# EAGLE design LiFePO4_Charger (EAGLE 9.6.2)
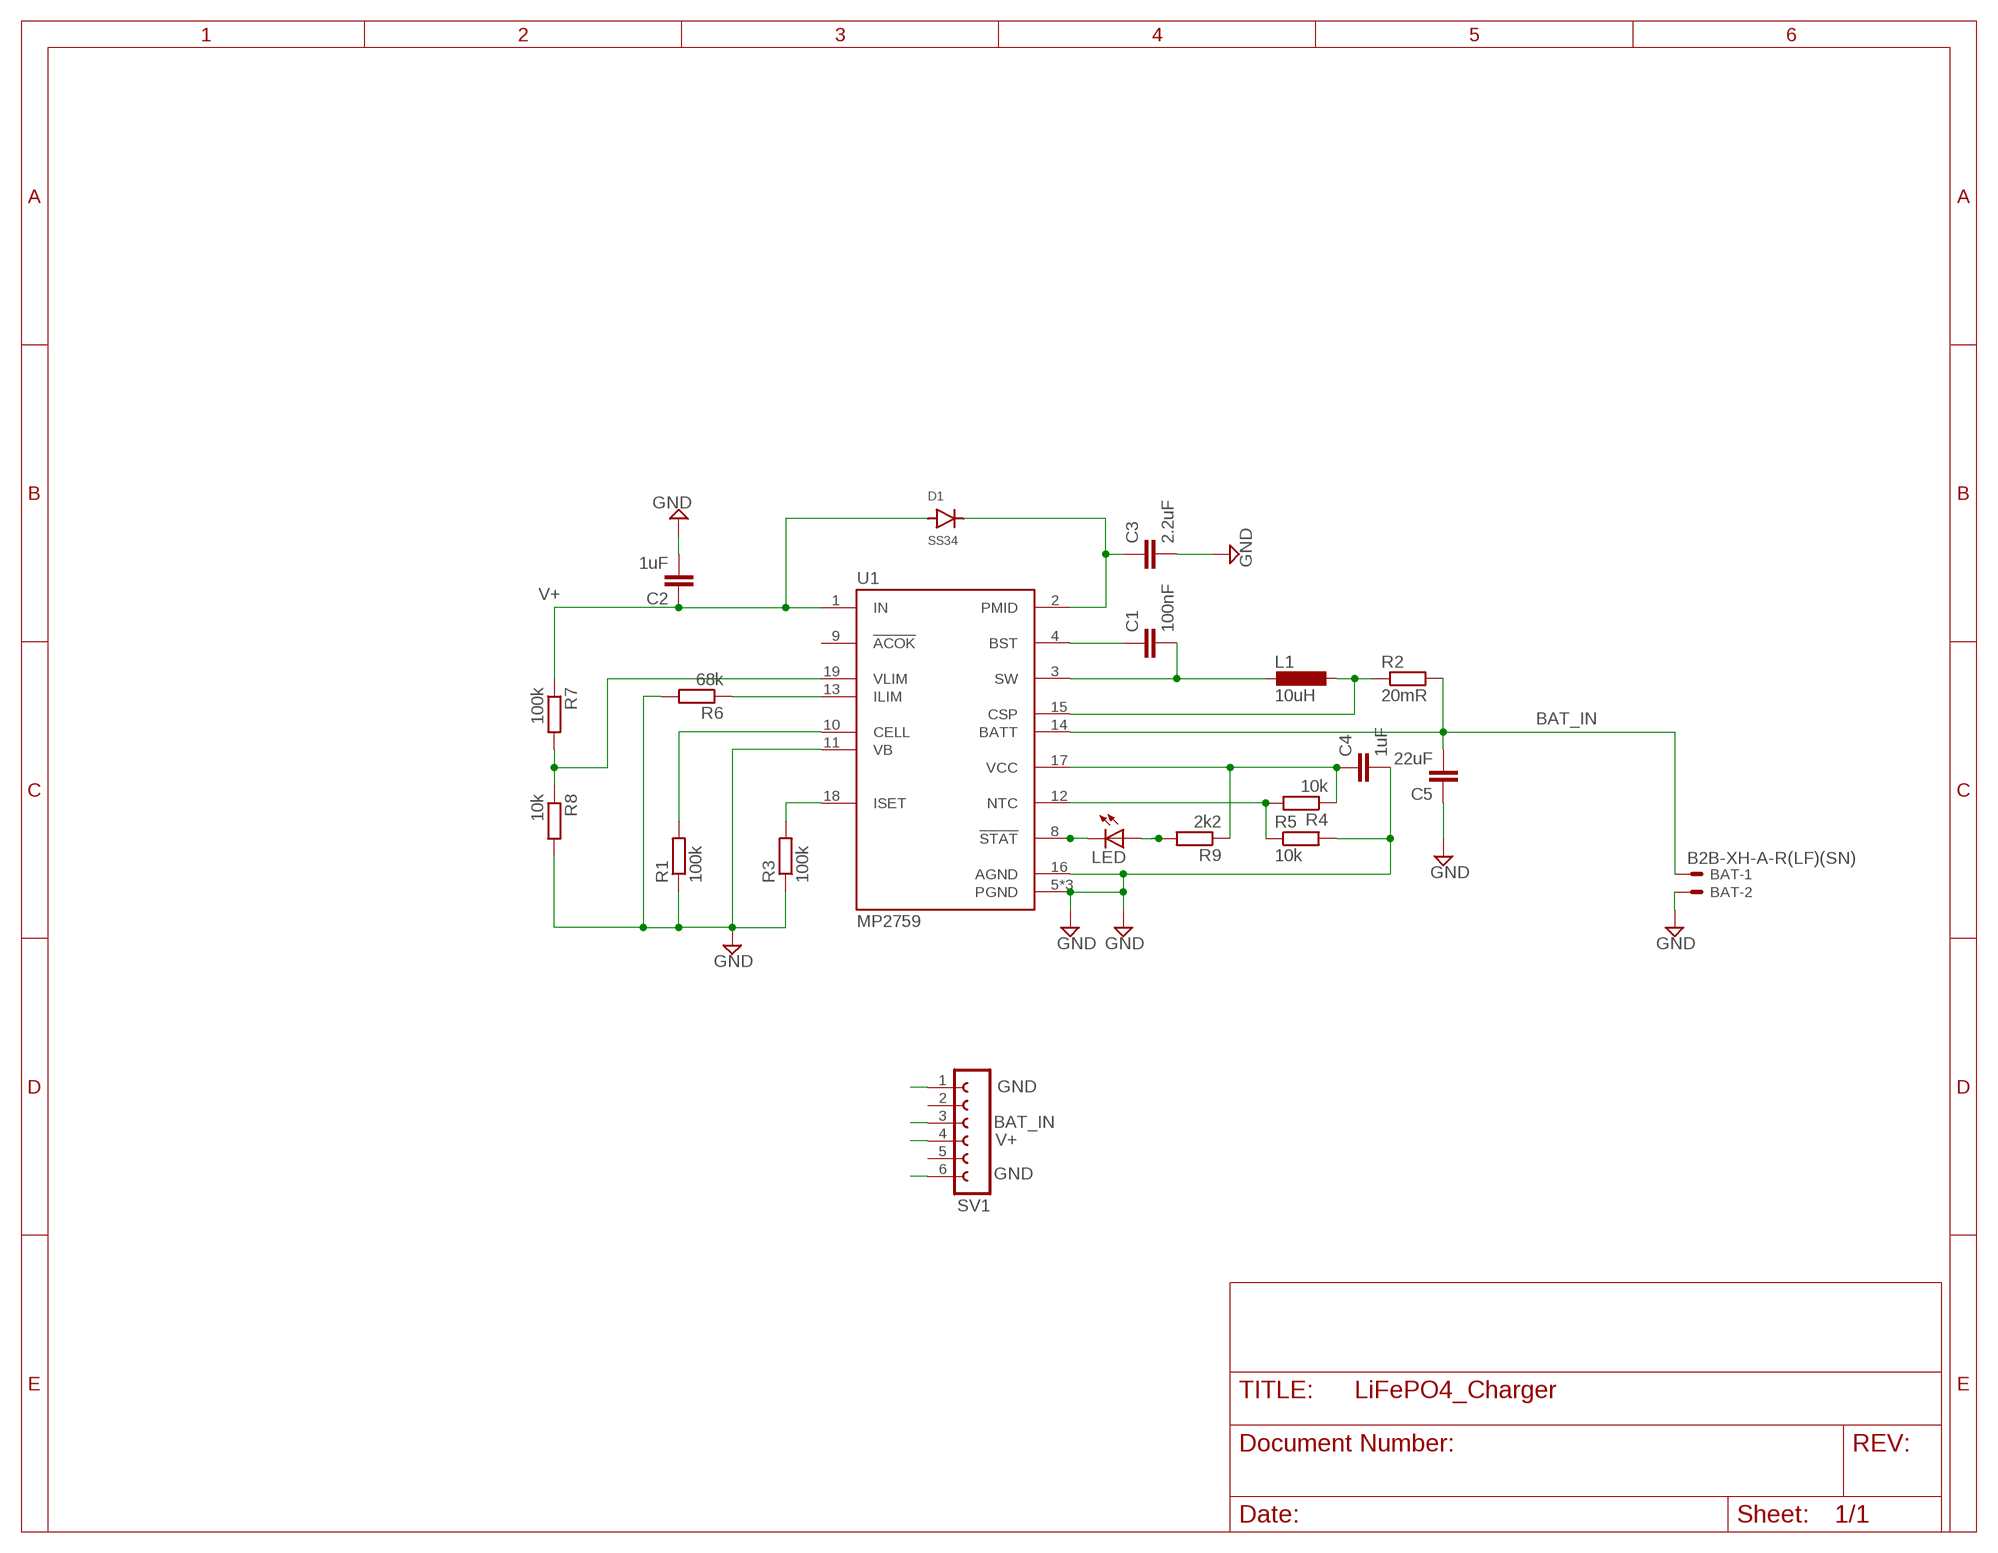
[diagram p0: schematic, sheet 1]

## Parts
BAT  B2B-XH-A-R(LF)(SN)  JST-XH-02-PIN-LONG-PAD  [JST-XH-02-PACKAGE-LONG-PAD]
C1  100nF  C-EUC0805  [C0805]
C2  1uF  C-EUC0805  [C0805]
C3  2.2uF  C-EUC0805  [C0805]
C4  1uF  C-EUC0805  [C0805]
C5  22uF  C-EUC0805  [C0805]
D1  SS34  S1M  [SMA]
L1  10uH  FXL0630-100-M  [FXL0630-100-M]
LED  LEDCHIPLED_0805  [CHIPLED_0805]
R1  100k  R-EU_R0603  [R0603]
R2  20mR  R-EU_R1206  [R1206]
R3  100k  R-EU_R0603  [R0603]
R4  10k  R-EU_R0603  [R0603]
R5  10k  R-EU_R0603  [R0603]
R6  68k  R-EU_R0603  [R0603]
R7  100k  R-EU_R0603  [R0603]
R8  10k  R-EU_R0603  [R0603]
R9  2k2  R-EU_R0603  [R0603]
SV1  FE06W  [FE06W]
U1  MP2759  MP2759GQ-0000-P  [IC_MP2759GQ-0000-P]

## Nets
BAT_IN [pwr]: BAT.1 C5.2 R2.2 SV1.3 U1.14(BATT)
BST: C1.1 U1.4(BST)
GND [pwr]: BAT.2 C2.2 C3.2 C4.2 C5.1 R1.1 R3.1 R5.2 R6.2 R8.2 SV1.1 SV1.6 U1.5(PGND) U1.6(PGND) U1.7(PGND) U1.11(VB) U1.16(AGND)
N$2: R1.2 U1.10(CELL)
N$5: C3.1 D1.C U1.2(PMID)
N$7: L1.P$2 R2.1 U1.15(CSP)
N$9: R3.2 U1.18(ISET)
N$11: R4.2 R5.1 U1.12(NTC)
N$12: R6.1 U1.13(ILIM)
N$13: LED.C U1.8(!STAT)
N$14: R7.2 R8.1 U1.19(VLIM)
N$15: LED.A R9.2
SW [pwr]: C1.2 L1.P$1 U1.3(SW)
V+ [pwr]: C2.1 D1.A R7.1 SV1.4 U1.1(IN)
VCC: C4.1 R4.1 R9.1 U1.17(VCC)
Unconnected: SV1.2 SV1.5 U1.9(!ACOK)

## Library data of the parts
BAT = Rembrandt Electronics - JST XH Connectors v1-0:JST-XH-02-PIN: JST XH Connector 2 Pin Wire to board connector. Pitch: 2,54 mm, (0.100") Number of pins: 2 Created by Rembrandt Electronics www.rembrandtelectronics.com
C1-C5 = rcl:C-EU: CAPACITOR, European symbol; SPICEPREFIX: C
D1 = diode:S1M
L1 = MK312parts:FXL0630-100-M
LED = adafruit:LED: LED OSRAM: - CHIPLED LG R971, LG N971, LY N971, LG Q971, LY Q971, LO R971, LY R971 LH N974, LH R974 LS Q976, LO Q976, LY Q976 LO Q996 - Hyper CHIPLED LW Q18S LB Q993, LB Q99A, LB R99A - SideLED LS A670, LO A670, LY A670, LG A670, LP A670 LB A673, LV A673, LT A673, LW A673 LH A674 LY A675 LS A676, LA A676, LO A676, LY A676, LW A676 LS A679, LY A679, LG A679 - Hyper Micro SIDELED® LS Y876, LA Y876, LO Y876, LY Y876 LT Y87S - SmartLED LW L88C, LW L88S LB L89C, LB L89S, LG L890 LS L89K, LO L89K, LY L89K LS L896, LA L896, LO L896, LY L896 - TOPLED LS T670, LO T670, LY T670, LG T670, LP T670 LSG T670, LSP T670, LSY T670, LOP T670, LYG T670 LG T671, LOG T671, LSG T671 LB T673, LV T673, LT T673, LW T673 LH T674 LS T676, LA T676, LO T676, LY T676, LB T676, LH T676, LSB T676, LW T676 LB T67C, LV T67C, LT T67C, LS T67K, LO T67K, LY T67K, LW E67C LS E67B, LA E67B, LO E67B, LY E67B, LB E67C, LV E67C, LT E67C LW T67C LS T679, LY T679, LG T679 LS T770, LO T770, LY T770, LG T770, LP T770 LB T773, LV T773, LT T773, LW T773 LH T774 LS E675, LA E675, LY E675, LS T675 LS T776, LA T776, LO T776, LY T776, LB T776 LHGB T686 LT T68C, LB T68C - Hyper Mini TOPLED® LB M676 - Mini TOPLED Santana® LG M470 LS M47K, LO M47K, LY M47K Source: http://www.osram.convergy.de/
R1-R9 = rcl:R-EU_: RESISTOR, European symbol; SPICEPREFIX: R
SV1 = con-lsta:FE06W: FEMALE HEADER; OC_FARNELL: unknown; OC_NEWARK: unknown
U1 = SnapEDA:MP2759GQ-0000-P: Check availability <https://pricing.snapeda.com/parts/MP2759GQ-0000-P/Monolithic%20Power%20Systems%20Inc./view-part?ref=eda>; AVAILABILITY: In Stock; CHECK_PRICES: https://www.snapeda.com/parts/MP2759GQ-0000-P/Monolithic+Power+Systems/view-part/?ref=eda; DESCRIPTION: Charger IC Lithium Ion/Polymer 19-QFN (3x3); MF: Monolithic Power Systems Inc.; MP: MP2759GQ-0000-P; PACKAGE: PowerVQFN-19 Monolithic Power Systems Inc.; PRICE: None; SNAPEDA_LINK: https://www.snapeda.com/parts/MP2759GQ-0000-P/Monolithic+Power+Systems/view-part/?ref=snap

## Net classes
0 default: width 0.15 mm, drill 0.35 mm, clearance 0.15 mm
2 pwr: width 0.15 mm, drill 0.35 mm, clearance 0.15 mm

## Board
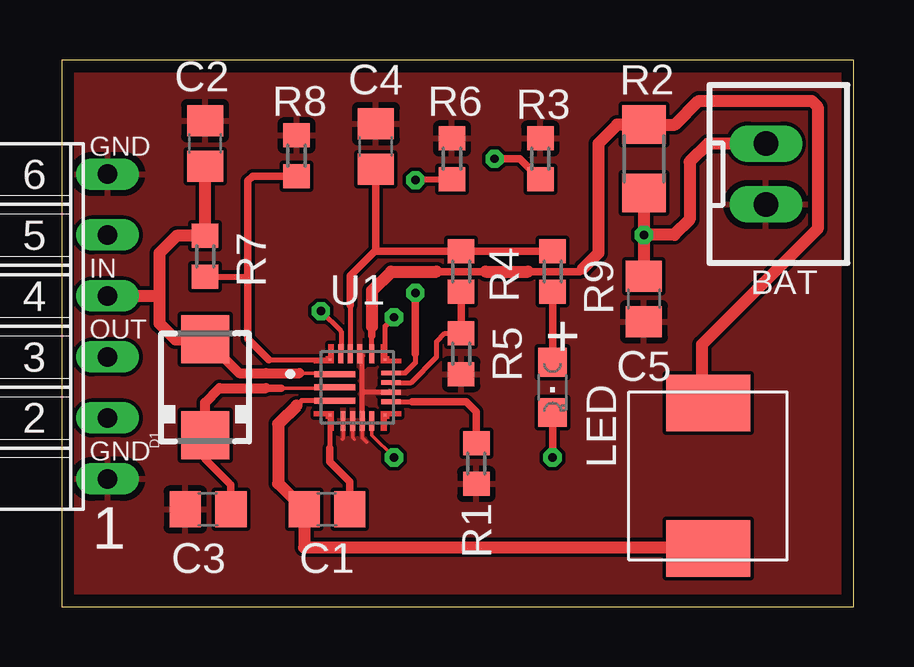
[diagram p1: board, top side]
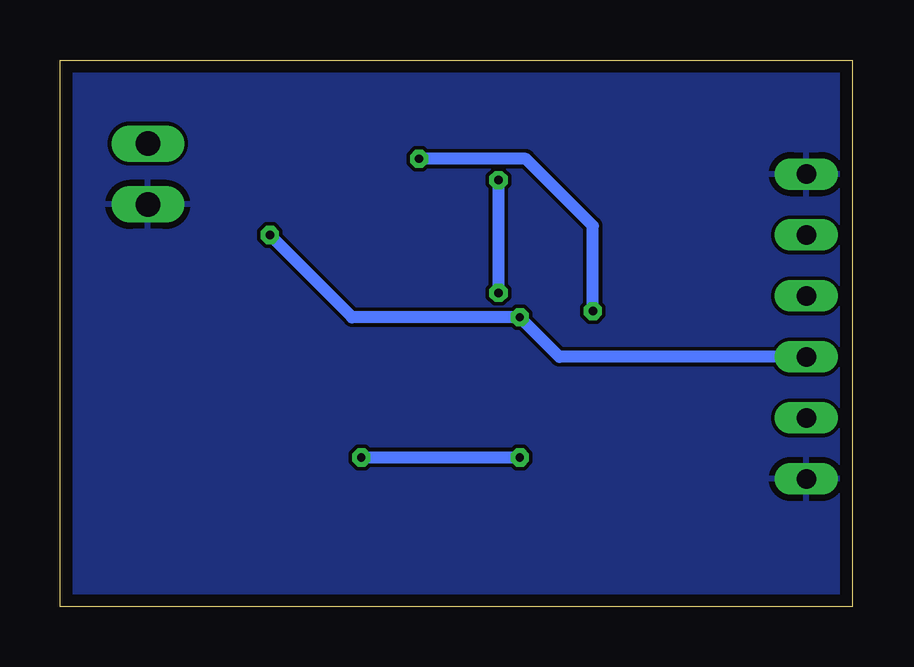
[diagram p2: board, bottom side, seen from below]

Size 33 x 22.78 mm. Coordinates in mm from the lower left corner, seen from the top.
Outline: 0,0 33,0 33,22.78 0,22.78 0,0
Copper layers (1*16): Top 0.035mm / dielectric 1.5mm / Bottom 0.035mm
Design rules "default *": minimum track width 6mil, minimum drill 0.35mm, track to track 6mil, track to pad 6mil, pad to pad 6mil, via to via 6mil, smd to smd 6mil, copper to edge 20mil, drill to drill 6mil, minimum pad ring 10mil, minimum via ring 8mil, stop-mask expansion 4mil, vias tented up to drill 0mil, thermal gap 10mil

### Footprints (pad centres in the part's own frame; a part is rotated, then mirrored left to right if it is on the bottom)
JST-XH-02-PACKAGE-LONG-PAD = drill 1.016 long: 1 -1.27,0; 2 1.27,0
C0805 = smd 1.3 x 1.5: 1 -0.95,0; 2 0.95,0
SMA = smd 2 x 2: A 2,0; C -2,0
FXL0630-100-M = smd 2.37 x 3.5: P$1 -3.03,0; P$2 3.03,0
CHIPLED_0805 = smd 1.2 x 1.2: A 0,-1.05; C 0,1.05
R0603 = smd 1 x 1.1: 1 -0.85,0; 2 0.85,0
R1206 = smd 1.6 x 1.803: 1 -1.422,0; 2 1.422,0
FE06W = drill 0.813 long: 1 -6.35,0; 2 -3.81,0; 3 -1.27,0; 4 1.27,0; 5 3.81,0; 6 6.35,0
IC_MP2759GQ-0000-P = smd 1.7 x 0.25: 1 -0.95,0.55; 2 -0.95,0; 3 -0.95,-0.55 | smd 0.1 x 0.1: 4 -1.15,-1.15; 9 1.15,-1.15; 14 1.15,1.15; 19 -1.15,1.15 | smd 0.2 x 0.8: 5 -0.6,-1.4; 6 -0.2,-1.4; 7 0.2,-1.4; 8 0.6,-1.4; 15 0.6,1.4; 16 0.1,1.4; 17 -0.3,1.4; 18 -0.7,1.4 | smd 0.8 x 0.2: 10 1.4,-0.6; 11 1.4,-0.2; 12 1.4,0.2; 13 1.4,0.6

### Placement (x,y rotation side)
BAT  29.34,18.03 270 top
C1  11.05,4.06 180 top
C2  5.97,19.3 90 top
C3  6.1,4.06 180 top
C4  13.08,19.18 90 top
C5  24.26,12.83 90 top
D1  5.97,9.14 90 top
L1  26.92,5.46 90 top
LED  20.45,9.14 180 top
R1  17.27,5.97 90 top
R2  24.26,18.67 270 top
R3  19.94,18.67 270 top
R4  16.64,13.97 270 top
R5  16.64,10.54 270 top
R6  16.26,18.67 90 top
R7  5.97,14.61 270 top
R8  9.78,18.8 90 top
R9  20.45,13.97 270 top
SV1  1.91,11.68 90 top
U1  12.32,9.14 0 top

### Tracks (layer width: path | path; a pad name or v marks a point on that pad's centre or on a via)
BAT_IN  (via drill 0.35)
  Top 0.2: U1.14 13.47,11.69 v13.84,12.06
  Top 0.508: R2.2 v24.26,15.49 | v24.26,15.49 C5.2 | BAT.1 26.92,19.3 26.16,18.54 26.16,16.13 25.53,15.49 v24.26,15.49
  Bottom 0.508: SV1.3 12.19,10.41 v13.84,12.06 20.83,12.06 v24.26,15.49
BST
  Top 0.2: U1.4 11.17,6.6
  Top 0.305: C1.1 12,5.21 11.17,6.04 11.17,6.6
GND
  Top 0.152: U1.5 11.72,7.02 11.68,6.99 | U1.6 12.12,7.06 12.19,6.99 | U1.7 12.52,7.04 12.7,6.86
  Top 0.203: U1.7 12.52,8.89 | 12.52,8.89 12.52,10.44 U1.16 | U1.11 12.57,8.94 12.52,8.89
  pour Top: 32.51,22.61 32.77,22.35 32.77,0.38 32.51,0.13 0.51,0.13 0.25,0.38 0.25,22.35 0.51,22.61
  pour Bottom: 0.51,22.61 32.51,22.61 32.77,22.35 32.77,0.38 32.51,0.13 0.51,0.13 0.25,0.38 0.25,22.35
N$2
  Top 0.2: U1.10 14.61,8.54
  Top 0.305: 14.61,8.54 16.86,8.54 17.27,8.13 R1.2
N$5
  Top 0.152: 9.14,9.11 11.26,9.11 U1.2
  Top 0.203: D1.C 5.97,6.76
  Top 0.254: 5.97,6.76 5.97,6.16 | 7.05,5.08 6.95,5.17
  Top 0.305: C3.1 7.05,5.08 | 6.95,5.17 5.97,6.16 5.97,7.37 | 8.51,9.11 9.14,9.11
  Top 0.406: D1.C 5.97,7.37 5.97,8.51 6.57,9.11 8.51,9.11
N$7
  Top 0.203: U1.15 12.92,11.3
  Top 0.305: 12.92,11.68 12.92,11.3 | 15.62,13.97 17.65,13.97 | 19.43,13.97 21.59,13.97 21.72,14.1
  Top 0.508: 21.72,14.1 22.35,14.73 22.35,19.3 23.14,20.09 R2.1 25.55,20.09 26.54,21.08 31.24,21.08 31.5,20.83 31.5,15.75 26.67,10.92 26.67,8.74 L1.P$2 | 12.92,11.68 12.92,13.17 13.72,13.97 15.62,13.97 | 17.65,13.97 19.43,13.97
N$9  (via drill 0.35)
  Top 0.152: 11.64,10.61 U1.18
  Top 0.203: v10.79,12.32 11.64,11.47 11.64,10.61
  Top 0.305: v18.03,18.67 19.09,18.67 R3.2
  Bottom 0.508: v10.79,12.32 10.79,15.88 13.59,18.67 v18.03,18.67
N$11
  Top 0.2: R5.1 15.96,11.39 15.62,11.05 15.62,10.41 14.55,9.34 U1.12
  Top 0.305: R4.2 R5.1
N$12  (via drill 0.35)
  Top 0.2: U1.13 14.32,9.74 14.73,10.16 14.73,10.54
  Top 0.254: v14.73,17.78 14.77,17.82 R6.1
  Top 0.305: v14.73,13.08 14.73,10.54
  Bottom 0.508: v14.73,17.78 v14.73,13.08
N$13  (via drill 0.35)
  Top 0.152: U1.8 12.92,7.15 v13.84,6.22
  Top 0.305: v20.45,6.22 LED.C
  Bottom 0.508: v20.45,6.22 v13.84,6.22
N$14
  Top 0.2: 8.63,10.29 U1.19
  Top 0.203: 7.71,13.76 7.75,13.72
  Top 0.254: 7.75,11.18 7.75,13.72 7.75,17.75 | R7.2 7.71,13.76
  Top 0.305: R8.1 7.95,17.95 7.75,17.75 7.75,11.18 8.63,10.29
N$15
  Top 0.305: R9.2 LED.A
SW
  Top 0.2: U1.3 9.99,8.59 9.78,8.38 | 9.02,5.15 9.11,5.05 | 9.02,7.62 9.08,7.68
  Top 0.406: 10,4.16 C1.2
  Top 0.508: 9.02,7.62 9.02,5.15 | C1.2 10.1,2.48 26.88,2.48 L1.P$1 | 9.08,7.68 9.78,8.38 | 9.11,5.05 10,4.16
V+
  Top 0.152: 8.51,9.73 9.91,9.73 11.26,9.73 U1.1 | 6.01,11.11 D1.A
  Top 0.406: 6.01,11.11 7.39,9.73 8.51,9.73 9.91,9.73
  Top 0.508: C2.1 R7.1 4.79,15.46 4.06,14.73 4.06,12.95 | 4.06,12.95 4.06,11.81 4.73,11.14 D1.A | SV1.4 4.06,12.95
VCC
  Top 0.2: 12.02,12.57 U1.17
  Top 0.254: R9.1 R4.1 13.08,14.82 13.08,14.86
  Top 0.305: 13.08,14.82 R9.1 | 12.02,12.57 12.02,13.8 13.08,14.86 C4.1

### Text on the board
tNames: GND | IN | OUT | + | GND | 1